# Altium schematic sheet 2_cyber60-smk_matrix.SchDoc: =ProjectTitle
size A3; Address1: github.com/4pplet/cyber60; Address2: Licence: CERN-OHL-S; SheetNumber: 2; SheetTotal: 5
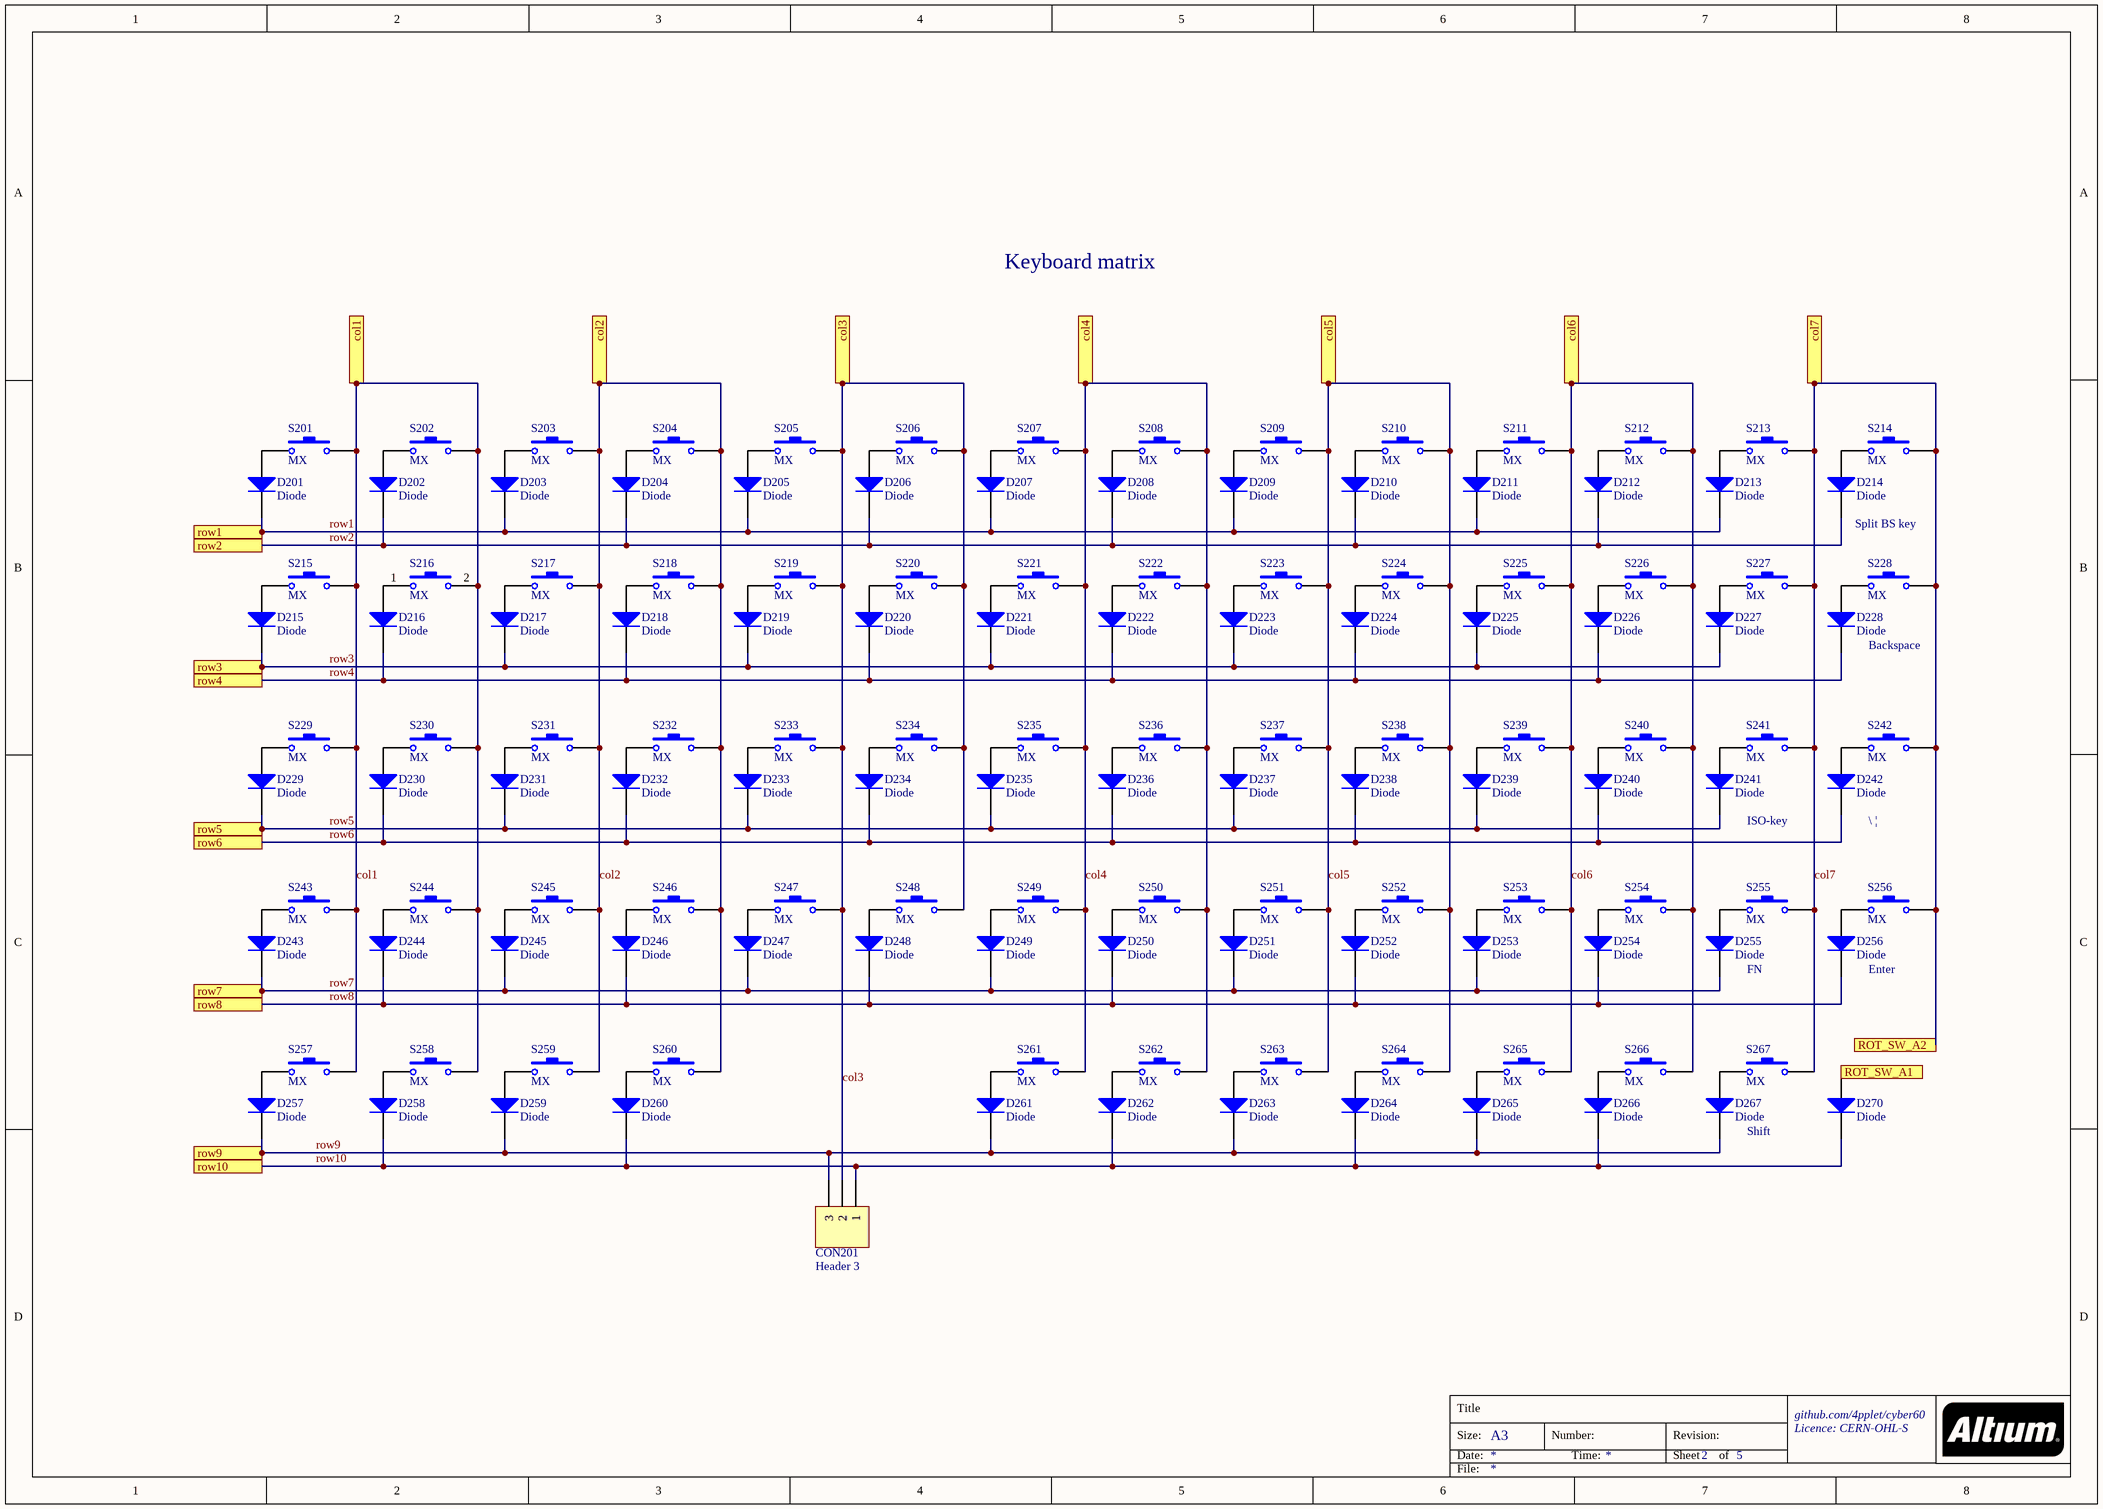
[diagram p0: 2_cyber60-smk_matrix.SchDoc]

## Parts
CON201  Header 3  [HDR1X3]  (no BOM)
D201  Diode  [SOD-123]
D202  Diode  [SOD-123]
D203  Diode  [SOD-123]
D204  Diode  [SOD-123]
D205  Diode  [SOD-123]
D206  Diode  [SOD-123]
D207  Diode  [SOD-123]
D208  Diode  [SOD-123]
D209  Diode  [SOD-123]
D210  Diode  [SOD-123]
D211  Diode  [SOD-123]
D212  Diode  [SOD-123]
D213  Diode  [SOD-123]
D214  Diode  [SOD-123]
D215  Diode  [SOD-123]
D216  Diode  [SOD-123]
D217  Diode  [SOD-123]
D218  Diode  [SOD-123]
D219  Diode  [SOD-123]
D220  Diode  [SOD-123]
D221  Diode  [SOD-123]
D222  Diode  [SOD-123]
D223  Diode  [SOD-123]
D224  Diode  [SOD-123]
D225  Diode  [SOD-123]
D226  Diode  [SOD-123]
D227  Diode  [SOD-123]
D228  Diode  [SOD-123]
D229  Diode  [SOD-123]
D230  Diode  [SOD-123]
D231  Diode  [SOD-123]
D232  Diode  [SOD-123]
D233  Diode  [SOD-123]
D234  Diode  [SOD-123]
D235  Diode  [SOD-123]
D236  Diode  [SOD-123]
D237  Diode  [SOD-123]
D238  Diode  [SOD-123]
D239  Diode  [SOD-123]
D240  Diode  [SOD-123]
D241  Diode  [SOD-123]
D242  Diode  [SOD-123]
D243  Diode  [SOD-123]
D244  Diode  [SOD-123]
D245  Diode  [SOD-123]
D246  Diode  [SOD-123]
D247  Diode  [SOD-123]
D248  Diode  [SOD-123]
D249  Diode  [SOD-123]
D250  Diode  [SOD-123]
D251  Diode  [SOD-123]
D252  Diode  [SOD-123]
D253  Diode  [SOD-123]
D254  Diode  [SOD-123]
D255  Diode  [SOD-123]
D256  Diode  [SOD-123]
D257  Diode  [SOD-123]
D258  Diode  [SOD-123]
D259  Diode  [SOD-123]
D260  Diode  [SOD-123]
D261  Diode  [SOD-123]
D262  Diode  [SOD-123]
D263  Diode  [SOD-123]
D264  Diode  [SOD-123]
D265  Diode  [SOD-123]
D266  Diode  [SOD-123]
D267  Diode  [SOD-123]
D270  Diode  [SOD-123]
S201  MX  [SMK-switch - switched polarity]  (no BOM)
S202  MX  [SMK-switch - switched polarity]  (no BOM)
S203  MX  [SMK-switch - switched polarity]  (no BOM)
S204  MX  [SMK-switch]  (no BOM)
S205  MX  [SMK-switch - switched polarity]  (no BOM)
S206  MX  [SMK-switch - switched polarity]  (no BOM)
S207  MX  [SMK-switch - switched polarity]  (no BOM)
S208  MX  [SMK-switch - switched polarity]  (no BOM)
S209  MX  [SMK-switch - switched polarity]  (no BOM)
S210  MX  [SMK-switch - switched polarity]  (no BOM)
S211  MX  [SMK-switch]  (no BOM)
S212  MX  [SMK-switch - switched polarity]  (no BOM)
S213  MX  [SMK-switch]  (no BOM)
S214  MX  [SMK-switch]  (no BOM)
S215  MX  [SMK-switch - 1.5U]  (no BOM)
S216  MX  [SMK-switch - switched polarity]  (no BOM)
S217  MX  [SMK-switch - switched polarity]  (no BOM)
S218  MX  [SMK-switch - switched polarity]  (no BOM)
S219  MX  [SMK-switch - switched polarity]  (no BOM)
S220  MX  [SMK-switch]  (no BOM)
S221  MX  [SMK-switch - switched polarity]  (no BOM)
S222  MX  [SMK-switch - switched polarity]  (no BOM)
S223  MX  [SMK-switch - switched polarity]  (no BOM)
S224  MX  [SMK-switch - switched polarity]  (no BOM)
S225  MX  [SMK-switch - switched polarity]  (no BOM)
S226  MX  [SMK-switch]  (no BOM)
S227  MX  [SMK-switch]  (no BOM)
S228  MX  [SMK-switch - backspace]  (no BOM)
S229  MX  [SMK-switch - CAPS]  (no BOM)
S230  MX  [SMK-switch - switched polarity]  (no BOM)
S231  MX  [SMK-switch - switched polarity]  (no BOM)
S232  MX  [SMK-switch - switched polarity]  (no BOM)
S233  MX  [SMK-switch - switched polarity]  (no BOM)
S234  MX  [SMK-switch]  (no BOM)
S235  MX  [SMK-switch - switched polarity]  (no BOM)
S236  MX  [SMK-switch - switched polarity]  (no BOM)
S237  MX  [SMK-switch - switched polarity]  (no BOM)
S238  MX  [SMK-switch - switched polarity]  (no BOM)
S239  MX  [SMK-switch]  (no BOM)
S240  MX  [SMK-switch - switched polarity]  (no BOM)
S241  MX  [SMK-switch]  (no BOM)
S242  MX  [SMK-switch - 1.5U]  (no BOM)
S243  MX  [SMK-switch - Left shift v2]  (no BOM)
S244  MX  [SMK-switch - switched polarity]  (no BOM)
S245  MX  [SMK-switch - switched polarity]  (no BOM)
S246  MX  [SMK-switch - switched polarity]  (no BOM)
S247  MX  [SMK-switch - switched polarity]  (no BOM)
S248  MX  [SMK-switch]  (no BOM)
S249  MX  [SMK-switch - switched polarity]  (no BOM)
S250  MX  [SMK-switch - switched polarity]  (no BOM)
S251  MX  [SMK-switch - switched polarity]  (no BOM)
S252  MX  [SMK-switch - switched polarity]  (no BOM)
S253  MX  [SMK-switch - switched polarity]  (no BOM)
S254  MX  [SMK-switch - switched polarity]  (no BOM)
S255  MX  [SMK-switch]  (no BOM)
S256  MX  [SMK-switch - Enter]  (no BOM)
S257  MX  [SMK-switch - 1.5u MOD-L]  (no BOM)
S258  MX  [SMK-switch - L_WIN V2]  (no BOM)
S259  MX  [SMK-switch - L_ALT V2]  (no BOM)
S260  MX  [SMK-switch - L split space_V2]  (no BOM)
S261  MX  [SMK-switch - Space_V3]  (no BOM)
S262  MX  [SMK-switch - R split space_V2]  (no BOM)
S263  MX  [SMK-switch - switched polarity]  (no BOM)
S264  MX  [SMK-switch - R_ALT V2]  (no BOM)
S265  MX  [SMK-switch - R_WIN V2]  (no BOM)
S266  MX  [SMK-switch - 1.5u MOD-R]  (no BOM)
S267  MX  [SMK-switch - right shift v2]  (no BOM)

## Ports
col1, col2, col3, col4, col5, col6, col7, ROT_SW_A1, ROT_SW_A2, row1, row2, row3, row4, row5, row6, row7, row8, row9, row10

## Nets
col1: S201.1 S202.2 S215.1 S216.2 S229.1 S230.2 S243.1 S244.2 S257.1 S258.2 ; port col1
col2: S203.2 S204.2 S217.2 S218.2 S231.2 S232.2 S245.2 S246.2 S259.2 S260.2 ; port col2
col3: CON201.2 S205.2 S206.2 S219.2 S220.2 S233.2 S234.2 S247.2 S248.2 ; port col3
col4: S207.2 S208.2 S221.2 S222.2 S235.2 S236.2 S249.2 S250.2 S261.1 S262.2 ; port col4
col5: S209.2 S210.2 S223.2 S224.2 S237.2 S238.2 S251.2 S252.2 S263.2 S264.2 ; port col5
col6: S211.2 S212.2 S225.2 S226.2 S239.2 S240.2 S253.2 S254.2 S265.2 S266.2 ; port col6
col7: S213.2 S214.2 S227.2 S228.1 S241.2 S242.2 S255.2 S256.1 S267.2 ; port col7, port ROT_SW_A2
ROT_SW_A1: D270.1(A) ; port ROT_SW_A1
row1: D201.2(K) D203.2(K) D205.2(K) D207.2(K) D209.2(K) D211.2(K) D213.2(K) ; port row1
row2: D202.2(K) D204.2(K) D206.2(K) D208.2(K) D210.2(K) D212.2(K) D214.2(K) ; port row2
row3: D215.2(K) D217.2(K) D219.2(K) D221.2(K) D223.2(K) D225.2(K) D227.2(K) ; port row3
row4: D216.2(K) D218.2(K) D220.2(K) D222.2(K) D224.2(K) D226.2(K) D228.2(K) ; port row4
row5: D229.2(K) D231.2(K) D233.2(K) D235.2(K) D237.2(K) D239.2(K) D241.2(K) ; port row5
row6: D230.2(K) D232.2(K) D234.2(K) D236.2(K) D238.2(K) D240.2(K) D242.2(K) ; port row6
row7: D243.2(K) D245.2(K) D247.2(K) D249.2(K) D251.2(K) D253.2(K) D255.2(K) ; port row7
row8: D244.2(K) D246.2(K) D248.2(K) D250.2(K) D252.2(K) D254.2(K) D256.2(K) ; port row8
row9: CON201.3 D257.2(K) D259.2(K) D261.2(K) D263.2(K) D265.2(K) D267.2(K) ; port row9
row10: CON201.1 D258.2(K) D260.2(K) D262.2(K) D264.2(K) D266.2(K) D270.2(K) ; port row10
NetD201_1: D201.1(A) S201.2
NetD202_1: D202.1(A) S202.1
NetD203_1: D203.1(A) S203.1
NetD204_1: D204.1(A) S204.1
NetD205_1: D205.1(A) S205.1
NetD206_1: D206.1(A) S206.1
NetD207_1: D207.1(A) S207.1
NetD208_1: D208.1(A) S208.1
NetD209_1: D209.1(A) S209.1
NetD210_1: D210.1(A) S210.1
NetD211_1: D211.1(A) S211.1
NetD212_1: D212.1(A) S212.1
NetD213_1: D213.1(A) S213.1
NetD214_1: D214.1(A) S214.1
NetD215_1: D215.1(A) S215.2
NetD216_1: D216.1(A) S216.1
NetD217_1: D217.1(A) S217.1
NetD218_1: D218.1(A) S218.1
NetD219_1: D219.1(A) S219.1
NetD220_1: D220.1(A) S220.1
NetD221_1: D221.1(A) S221.1
NetD222_1: D222.1(A) S222.1
NetD223_1: D223.1(A) S223.1
NetD224_1: D224.1(A) S224.1
NetD225_1: D225.1(A) S225.1
NetD226_1: D226.1(A) S226.1
NetD227_1: D227.1(A) S227.1
NetD228_1: D228.1(A) S228.2
NetD229_1: D229.1(A) S229.2
NetD230_1: D230.1(A) S230.1
NetD231_1: D231.1(A) S231.1
NetD232_1: D232.1(A) S232.1
NetD233_1: D233.1(A) S233.1
NetD234_1: D234.1(A) S234.1
NetD235_1: D235.1(A) S235.1
NetD236_1: D236.1(A) S236.1
NetD237_1: D237.1(A) S237.1
NetD238_1: D238.1(A) S238.1
NetD239_1: D239.1(A) S239.1
NetD240_1: D240.1(A) S240.1
NetD241_1: D241.1(A) S241.1
NetD242_1: D242.1(A) S242.1
NetD243_1: D243.1(A) S243.2
NetD244_1: D244.1(A) S244.1
NetD245_1: D245.1(A) S245.1
NetD246_1: D246.1(A) S246.1
NetD247_1: D247.1(A) S247.1
NetD248_1: D248.1(A) S248.1
NetD249_1: D249.1(A) S249.1
NetD250_1: D250.1(A) S250.1
NetD251_1: D251.1(A) S251.1
NetD252_1: D252.1(A) S252.1
NetD253_1: D253.1(A) S253.1
NetD254_1: D254.1(A) S254.1
NetD255_1: D255.1(A) S255.1
NetD256_1: D256.1(A) S256.2
NetD257_1: D257.1(A) S257.2
NetD258_1: D258.1(A) S258.1
NetD259_1: D259.1(A) S259.1
NetD260_1: D260.1(A) S260.1
NetD261_1: D261.1(A) S261.2
NetD262_1: D262.1(A) S262.1
NetD263_1: D263.1(A) S263.1
NetD264_1: D264.1(A) S264.1
NetD265_1: D265.1(A) S265.1
NetD266_1: D266.1(A) S266.1
NetD267_1: D267.1(A) S267.1

## Notes on the sheet
- Keyboard matrix
- (near D214) Split BS key
- (near D228) Backspace
- ISO-key
- (near D242) \ |
- (near D255) FN
- (near D256) Enter
- (near D267) Shift
- Title
- Size:
- Date:
- A3
- Number:
- Time:
- Revision:
- Sheet
- of
- File:

## Library data of the parts
CON201 = Header 3: Header, 3-Pin
D201-D267 D270 = Diode: Default Diode; MRF.Part: 1N4148W; LCSC MFG: ST(Semtech); Version: SOD-123; LCSC Part #: C81598
S201-S214 S216-S267 = SW-PB: Switch
S215 = SW-PB: TAB